# EAGLE schematic iot-home-control-schematic (EAGLE 7.3.0)
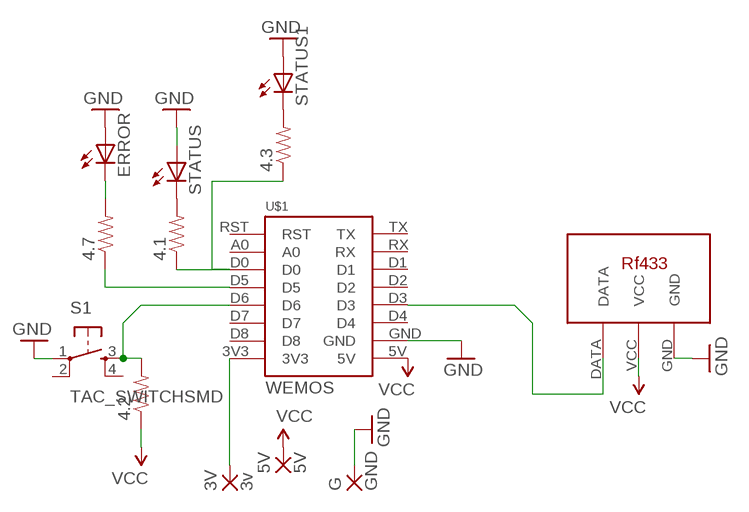
[diagram p0: schematic, sheet 1]

## Parts
3V  3v  2,15/1,0  [2,15/1,0]
4.1  RESISTOR0805-RES  [0805]
4.2  RESISTOR0805-RES  [0805]
4.3  RESISTOR0805-RES  [0805]
4.7  RESISTOR0805-RES  [0805]
5V  5V  2,15/1,0  [2,15/1,0]
ERROR  LEDCHIPLED_0805  [CHIPLED_0805]
G  GND  2,15/1,0  [2,15/1,0]
S1  TAC_SWITCHSMD  [TACTILE-SWITCH-SMD]
STATUS  LEDCHIPLED_0805  [CHIPLED_0805]
STATUS1  LEDCHIPLED_0805  [CHIPLED_0805]
U$1  WEMOS  [WEMOS]
U$2  RF433  [433MHZ]

## Nets
GND: ERROR.A G.1(P) S1.1 STATUS1.A STATUS.A U$1.GND U$2.GND
N$1: U$1.D3 U$2.DATA
N$2: 4.7.1 U$1.D5
N$3: 4.7.2 ERROR.C
N$4: 4.1.1 4.3.1 U$1.D0
N$5: 4.1.2 STATUS.C
N$7: 3V.1(P) U$1.3V3
N$8: 4.3.2 STATUS1.C
N$10: 4.2.2 S1.3 U$1.D6
VCC: 4.2.1 5V.1(P) U$1.5V U$2.VCC
Unconnected: S1.2 S1.4 U$1.A0 U$1.D1 U$1.D2 U$1.D4 U$1.D7 U$1.D8 U$1.RST U$1.RX U$1.TX

## Library data of the parts
3V 5V G = wirepad:2,15/1,0: THROUGH-HOLE PAD
4.1-4.3 4.7 = SparkFun-Passives:RESISTOR: Resistor Basic schematic elements and footprints for 0603, 1206, and PTH resistors.
ERROR STATUS STATUS1 = led:LED: LED OSRAM: - CHIPLED LG R971, LG N971, LY N971, LG Q971, LY Q971, LO R971, LY R971 LH N974, LH R974 LS Q976, LO Q976, LY Q976 LO Q996 - Hyper CHIPLED LW Q18S LB Q993, LB Q99A, LB R99A - SideLED LS A670, LO A670, LY A670, LG A670, LP A670 LB A673, LV A673, LT A673, LW A673 LH A674 LY A675 LS A676, LA A676, LO A676, LY A676, LW A676 LS A679, LY A679, LG A679 - Hyper Micro SIDELED® LS Y876, LA Y876, LO Y876, LY Y876 LT Y87S - SmartLED LW L88C, LW L88S LB L89C, LB L89S, LG L890 LS L89K, LO L89K, LY L89K LS L896, LA L896, LO L896, LY L896 - TOPLED LS T670, LO T670, LY T670, LG T670, LP T670 LSG T670, LSP T670, LSY T670, LOP T670, LYG T670 LG T671, LOG T671, LSG T671 LB T673, LV T673, LT T673, LW T673 LH T674 LS T676, LA T676, LO T676, LY T676, LB T676, LH T676, LSB T676, LW T676 LB T67C, LV T67C, LT T67C, LS T67K, LO T67K, LY T67K, LW E67C LS E67B, LA E67B, LO E67B, LY E67B, LB E67C, LV E67C, LT E67C LW T67C LS T679, LY T679, LG T679 LS T770, LO T770, LY T770, LG T770, LP T770 LB T773, LV T773, LT T773, LW T773 LH T774 LS E675, LA E675, LY E675, LS T675 LS T776, LA T776, LO T776, LY T776, LB T776 LHGB T686 LT T68C, LB T68C - Hyper Mini TOPLED® LB M676 - Mini TOPLED Santana® LG M470 LS M47K, LO M47K, LY M47K Source: http://www.osram.convergy.de LUXEON: - LUMILED® LXK2-PW12-R00, LXK2-PW12-S00, LXK2-PW14-U00, LXK2-PW14-V00 LXK2-PM12-R00, LXK2-PM12-S00, LXK2-PM14-U00 LXK2-PE12-Q00, LXK2-PE12-R00, LXK2-PE12-S00, LXK2-PE14-T00, LXK2-PE14-U00 LXK2-PB12-K00, LXK2-PB12-L00, LXK2-PB12-M00, LXK2-PB14-N00, LXK2-PB14-P00, LXK2-PB14-Q00 LXK2-PR12-L00, LXK2-PR12-M00, LXK2-PR14-Q00, LXK2-PR14-R00 LXK2-PD12-Q00, LXK2-PD12-R00, LXK2-PD12-S00 LXK2-PH12-R00, LXK2-PH12-S00 LXK2-PL12-P00, LXK2-PL12-Q00, LXK2-PL12-R00 Source: www.luxeon.com KINGBRIGHT: KA-3528ASYC Source: www.kingbright.com
S1 = SparkFun-Retired:TAC_SWITCH: Momentary Switch Button commonly used for reset or general input. Spark Fun Electronics SKU : COM-00097 SMT- SWCH-08247; PROD_ID: SWCH-08247
U$1 = wemos:WEMOS
U$2 = rf433:RF433: RF433